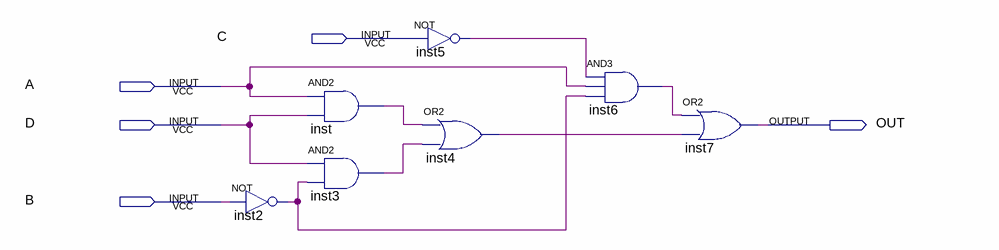
[diagram p0: schematic sheet]
// Quartus schematic Aula01.bdf as structural Verilog: 7 symbols, 5 pins
module Aula01 (
  input  C,
  input  A,
  input  D,
  input  B,
  output OUT
);

  wire inst2_out, inst3_out, inst4_out, inst5_out, inst6_out, inst_out;

  not inst2 (inst2_out, B);
  and inst (inst_out, A, D);
  and inst3 (inst3_out, D, inst2_out);
  not inst5 (inst5_out, C);
  or inst4 (inst4_out, inst_out, inst3_out);
  and inst6 (inst6_out, inst5_out, A, inst2_out);
  or inst7 (OUT, inst6_out, inst4_out);
endmodule
